# Altium schematic sheet Clock Sheet.SchDoc: Orologio
size A4; DrawnBy: Group 19; Revision: 1.0
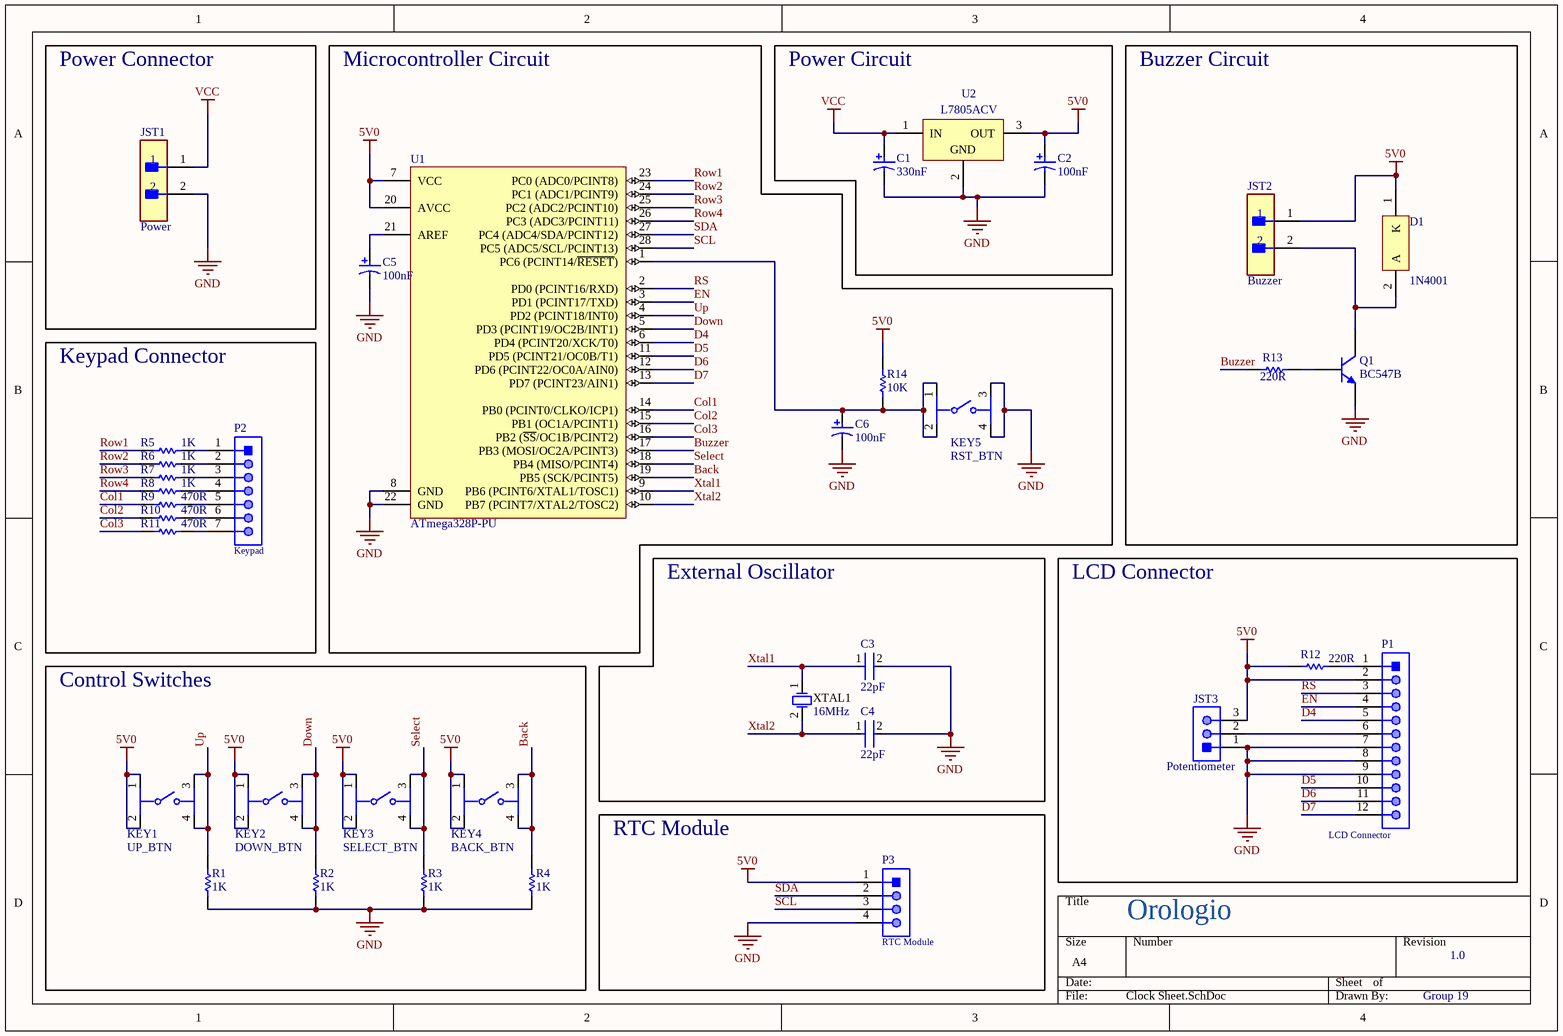
[diagram p0: Clock Sheet.SchDoc]

## Parts
C1  330nF  [CAPPR65-350-1150X800X1250]
C2  100nF  [CAPPR65-350-1150X800X1250]
C3  22pF  [FP-RCE0K1-MFG]
C4  22pF  [FP-RCE0K1-MFG]
C5  100nF  [CAPPR65-350-1150X800X1250]
C6  100nF  [CAPPR65-350-1150X800X1250]
D1  1N4001  [ONSC-AXIAL_LEAD-2-59-10_P]
JST1  Power  [FP-440054-2-MFG]
JST2  Buzzer  [FP-440054-2-MFG]
JST3  Potentiometer  [JST-B3B-PH-K-S-3_V]
KEY1  UP_BTN  [FP-1825910-2-0]
KEY2  DOWN_BTN  [FP-1825910-2-0]
KEY3  SELECT_BTN  [FP-1825910-2-0]
KEY4  BACK_BTN  [FP-1825910-2-0]
KEY5  RST_BTN  [FP-1825910-2-0]
P1  LCD Connector  [61301211121]
P2  Keypad  [61300711121]
P3  RTC Module  [61300411121]
Q1  BC547B  [ONSC-TO-92-3-29-11]
R1  1K  [AXIAL-0.3]
R2  1K  [AXIAL-0.3]
R3  1K  [AXIAL-0.3]
R4  1K  [AXIAL-0.3]
R5  1K  [AXIAL-0.3]
R6  1K  [AXIAL-0.3]
R7  1K  [AXIAL-0.3]
R8  1K  [AXIAL-0.3]
R9  470R  [AXIAL-0.3]
R10  470R  [AXIAL-0.3]
R11  470R  [AXIAL-0.3]
R12  220R  [AXIAL-0.3]
R13  220R  [AXIAL-0.3]
R14  10K  [AXIAL-0.3]
U1  ATmega328P-PU  [28P3]
U2  L7805ACV  [TO220]
XTAL1  16MHz  [FOX-FOXSLF160-20]

## Blocks framed on the sheet
Power Connector: JST1
Microcontroller Circuit: C5 C6 KEY5 R14 U1
Power Circuit: C1 C2 U2
Buzzer Circuit: D1 JST2 Q1 R13
Keypad Connector: P2 R5-R11
External Oscillator: C3 C4 XTAL1
LCD Connector: JST3 P1 R12
Control Switches: KEY1-KEY4 R1-R4
RTC Module: P3

## Nets
5V0: C2.1 D1.1(K) JST2.1 JST3.3 KEY1.1 KEY1.2 KEY2.1 KEY2.2 KEY3.1 KEY3.2 KEY4.1 KEY4.2 P1.2 P3.1 R12.1 R14.2 U1.7(VCC) U1.20(AVCC) U2.3(OUT)
GND: C1.2 C2.2 C3.2 C4.2 C5.2 C6.2 JST1.2 JST3.1 KEY5.3 KEY5.4 P1.7 P1.8 P1.9 P3.4 Q1.3(E) R1.2 R2.2 R3.1 R4.1 U1.8(GND) U1.22(GND) U2.2(GND)
VCC: C1.1 JST1.1 U2.1(IN)
Back: KEY4.3 KEY4.4 R4.2 U1.19(PB5_(SCK/PCINT5))
Buzzer: R13.1 U1.17(PB3_(MOSI/OC2A/PCINT3))
Col1: R9.2 U1.14(PB0_(PCINT0/CLKO/ICP1))
Col2: R10.2 U1.15(PB1_(OC1A/PCINT1))
Col3: R11.2 U1.16(PB2_(~{SS}/OC1B/PCINT2))
D4: P1.5 U1.6(PD4_(PCINT20/XCK/T0))
D5: P1.10 U1.11(PD5_(PCINT21/OC0B/T1))
D6: P1.11 U1.12(PD6_(PCINT22/OC0A/AIN0))
D7: P1.12 U1.13(PD7_(PCINT23/AIN1))
Down: KEY2.3 KEY2.4 R2.1 U1.5(PD3_(PCINT19/OC2B/INT1))
EN: P1.4 U1.3(PD1_(PCINT17/TXD))
Row1: R5.2 U1.23(PC0_(ADC0/PCINT8))
Row2: R6.2 U1.24(PC1_(ADC1/PCINT9))
Row3: R7.2 U1.25(PC2_(ADC2/PCINT10))
Row4: R8.2 U1.26(PC3_(ADC3/PCINT11))
RS: P1.3 U1.2(PD0_(PCINT16/RXD))
SCL: P3.3 U1.28(PC5_(ADC5/SCL/PCINT13))
SDA: P3.2 U1.27(PC4_(ADC4/SDA/PCINT12))
Select: KEY3.3 KEY3.4 R3.2 U1.18(PB4_(MISO/PCINT4))
Up: KEY1.3 KEY1.4 R1.1 U1.4(PD2_(PCINT18/INT0))
Xtal1: C3.1 U1.9(PB6_(PCINT6/XTAL1/TOSC1)) XTAL1.1
Xtal2: C4.1 U1.10(PB7_(PCINT7/XTAL2/TOSC2)) XTAL1.2
NetC5_1: C5.1 U1.21(AREF)
NetC6_1: C6.1 KEY5.1 KEY5.2 R14.1 U1.1(PC6_(PCINT14/~{RESET}))
NetD1_2: D1.2(A) JST2.2
NetJST3_2: JST3.2 P1.6
NetP1_1: P1.1 R12.2
NetP2_1: P2.1 R5.1
NetP2_2: P2.2 R6.1
NetP2_3: P2.3 R7.1
NetP2_4: P2.4 R8.1
NetP2_5: P2.5 R9.1
NetP2_6: P2.6 R10.1
NetP2_7: P2.7 R11.1
NetQ1_2: Q1.2(B) R13.2

Not connected (* = marked no-connect by the designer): Q1 1(C)

## Library data of the parts
C1 C2 C5 C6 = CMP-1665-00042-2: Aluminum Electrolytic Capacitor, 100 uF, +/- 20%, 50 V, -40 to 85 degC, 2-Pin THD, RoHS, Bulk; Manufacturer: Panasonic; Lead Diameter: 0.6mm; Dielectric Material: Aluminium; Voltage Rating (DC): 50V; Ripple Current (AC): 250mA; Polarity: Polar; Leakage Current: 3uA; Capacitance: 100uF; Life (Hours): 2000Hour; Lead/Base Style: Straight; Dissipation Factor: 0.12%; Radiation Hardening: No; Height: 11.5mm; Package Quantity: 200; Package Reference: CAPPR65-350-1150X800X1250; Min Operating Temperature: -40degC; Mount: ThroughHole; Package Description: 2-Pin Radial Lead, Dia 8 mm, Height 12.5 mm; Case/Package: Radial; Diameter: 8mm; Voltage Rating: 50V; Length: 11.5mm; REACH SVHC: NoSVHC; Height - Seated (Max): 0.492inch; Datasheet URL: https://industrial.panasonic.com/cdbs/www-data/pdf/RDF0000/ABA0000C1218.pdf; RoHSCompliant: true; Ripple Current: 250mA; Lead Free: LeadFree; Voltage: 50V; Manufacturer URL: http://www.panasonic.com/; Number of Pins: 2; Datasheet Version: Rev. 05, 10/2016; Packaging: Bulk; Termination: Radial; Max Operating Temperature: 85degC; Tolerance: 20%; Lead Pitch: 3.5mm
C3 C4 = CMP-06035-004895-1: Cap Ceramic 22pF 50V C0G ±5% Radial 5mm +125°C Automotive Bulk; Lead/Base Style: Formed Leads; Lead Diameter: 0.5mm; Max Operating Temperature: 125°C; Termination: Radial; Package Quantity: 2000; Capacitance: 22pF; Dielectric: C0G; Height - Seated (Max): 0.138inch; Width: 0.098inch; Lead Pitch: 0.197inch; Tolerance: 5%; Resistor Type: Ceramic; Case/Package: Radial; Mount: Through Hole; Voltage Rating: 50V; Ratings: AEC-Q200; Min Operating Temperature: -55°C; Packaging: Tape and Reel; Voltage Rating (DC): 50V; Height: 3.5mm; Length: 0.142inch
D1 = CMP-0902-00117-1: Standard Recovery Rectifier, 2-Pin Axial_Lead, Pb-Free, Bulk Bag; Manufacturer: On Semiconductor; VRRM Max (V): 50; IFSM Max (A): 30; IO(rec) Max (A): 1; ComponentLink3URL: http://www.onsemi.cn/pub_link/Collateral/59-10.PDF; ComponentLink3Description: Package Specification; PartNumber: 1N4001; PackageVersion: Rev. U, 02/2005; Packing: Bulk Bag; ComponentLink2Description: Datasheet; RoHS: TRUE; DatasheetVersion: Rev. 13; PackageReference: AXIAL_LEAD-2-59-10; ComponentLink1URL: http://www.onsemi.com/; Mounting Technology: Through Hole; PackageDescription: 2-Pin, Axial Lead, Diameter 2.35 mm; ComponentLink2URL: http://www.onsemi.com/pub_link/Collateral/1N4001-D.PDF; Type: Standard Recovery; ComponentLink1Description: Manufacturer URL
JST1 JST2 = CMP-03369-000005-1: CONN HEADER VERT 2POS 2MM; Manufacturer: TE Connectivity; Manufacturer Part Number: 440054-2; Conn Gender: Male; Conn Orientation: Vertical; Voltage Rating: 250V; Number Of Contacts: 2; Current Rating: 3A; ComponentLink2Description: Datasheet; Temperature Range Low: -25°C; Contact Material: Tin,Nickel; Device Class L3: unset; Digikey Description: CONN HEADER VERT 2POS 2MM; Temperature: -25°C to +85°C; Mouser Description: Headers & Wire Housings 2.0mm HDR 2pos VERT HPI; Package: 440054-2; Lead Free: Yes; ComponentLink2URL: https://www.te.com/usa-en/product-440054-2.datasheet.pdf; Number Of Rows: 1; Octopart: https://octopart.com/440054-2-te+connectivity-40237927; Category: Conn; Temperature Range High: +85°C; Footprint Url: https://www.te.com/commerce/DocumentDelivery/DDEController?Action=showdoc&DocId=Customer+Drawing%7F440054%7FF6%7Fpdf%7FEnglish%7FENG_CD_440054_F6.pdf%7F440054-2; Pitch: 2mm; Device Class L1: Connectors; RoHS: TRUE; Height: 6.35mm; Device Class L2: Headers and Wire Housings; Automotive: No
JST3 = CMP-2000-05164-1: Male Header, Pitch 2 mm, 1 x 3 Position, Height 6 mm, Tail Length 3.4 mm, -25 to 85 degC, RoHS, Bulk; Manufacturer: JST; Style/Orientation: StraightHeader/Plug; Pitch: 2mm; No of Positions: 3; Termination: Crimp; Manufacturer URL: http://www.jst.com/home2.html; Datasheet Version: Oct-06; Type: ShroudedHeader; Datasheet URL: https://datasheet.ciiva.com/11746/0900766b80826550-11746939.pdf
KEY1-KEY5 = CMP-03407-000004-1: SWITCH TACTILE SPST-NO 0.05A 24V; Manufacturer: TE; Manufacturer Part Number: 1825910-2; Contact Current Rating: 50mA; Operating Force: 160gf; Contact Resistance: 100mΩ; Electromechanical Life: 100000Cycles; Package: 0; ComponentLink2Description: Datasheet; Digikey Description: SWITCH TACTILE SPST-NO 0.05A 24V; Octopart: https://octopart.com/1825910-2-te+connectivity-42270502; Temperature Range Low: -35°C; Temperature Range High: +85°C; Lead Free: Yes; Device Class L2: Switches; Automotive: No; Temperature: -35°C to +85°C; Device Class L1: Electromechanical; Category: Switch; ComponentLink2URL: https://www.te.com/commerce/DocumentDelivery/DDEController?Action=showdoc&DocId=Customer+Drawing%7F1825910%7FC10%7Fpdf%7FEnglish%7FENG_CD_1825910_C10.pdf%7F1825910-2; Mount: Through Hole; RoHS: TRUE; Height: 4.6mm; Device Class L3: Tactile Switches; Voltage Rating Dc: 24V; Throw Configuration: SPST-NO
P1 = CMP-1502-01086-1: THT Vertical Pin Header WR-PHD, Pitch 2.54 mm, Single Row, 12 pins; Manufacturer: Wurth Elektronik; Pin Number: 12; Gender: Male; Working Voltage: 250VAC; Rated Current: 3A; Withstanding Voltage: 500VAC; Pitch: 2.54mm; Contact Resistance: 20mOhm; Orientation: Vertical; Package Reference: 61301211121; Packaging: Bag; Operating Temperature: -40to105degC; Mounting Technology: THT; Part Number: 61301211121; Manufacturer URL: http://www.we-online.de; Row Number: Single; Publisher: WurthElektronik; Datasheet URL: https://katalog.we-online.de/em/datasheet/6130xx11121.pdf
P2 = CMP-1502-01074-1: THT Vertical Pin Header WR-PHD, Pitch 2.54 mm, Single Row, 7 pins; Manufacturer: Wurth Elektronik; Pin Number: 7; Gender: Male; Working Voltage: 250VAC; Contact Resistance: 20mOhm; Rated Current: 3A; Pitch: 2.54mm; Withstanding Voltage: 500VAC; Row Number: Single; Packaging: Bag; Orientation: Vertical; Manufacturer URL: http://www.we-online.de; Datasheet URL: https://katalog.we-online.de/em/datasheet/6130xx11121.pdf; Part Number: 61300711121; Publisher: WurthElektronik; Operating Temperature: -40to105degC; Mounting Technology: THT; Package Reference: 61300711121
P3 = CMP-1502-01064-1: THT Vertical Pin Header WR-PHD, Pitch 2.54 mm, Single Row, 4 pins; Manufacturer: Wurth Elektronik; Withstanding Voltage: 500VAC; Rated Current: 3A; Working Voltage: 250VAC; Pin Number: 4; Gender: Male; Contact Resistance: 20mOhm; Pitch: 2.54mm; Manufacturer URL: http://www.we-online.de; Operating Temperature: -40to105degC; Packaging: Bag; Mounting Technology: THT; Package Reference: 61300411121; Datasheet URL: https://katalog.we-online.de/em/datasheet/6130xx11121.pdf; Publisher: WurthElektronik; Part Number: 61300411121; Row Number: Single; Orientation: Vertical
Q1 = NPN: NPN Bipolar Transistor; Published: 8-Jun-2000; LatestRevisionDate: 17-Jul-2002; LatestRevisionNote: Re-released for DXP Platform.; PackageReference: TO-226-AA; Publisher: Altium Limited; PackageDescription: TO, Flat Index; 3 In-Line, Axial Leads; Body Dia. 4.8mm; Leads 0.55 x 0.51 mm (max); Code_JEDEC: TO-226-AA
R1-R14 = Res1: Resistor; Published: 8-Jun-2000; LatestRevisionDate: 17-Jul-2002; LatestRevisionNote: Re-released for DXP Platform.; PackageReference: AXIAL-0.3; Publisher: Altium Limited; PackageDescription: Axial Device, Thru-Hole; 2 Leads; 0.3 in Pin Spacing
U1 = CMP-0095-00013-2: 8-bit AVR Microcontroller, 32KB Flash, 1KB EEPROM, 2KB SRAM, 28-pin PDIP, Industrial Grade (-40°C to 85°C); RevisionNote: DatasheetVersion updated. URLs added.; PackageVersion: revB, Sep-2001; PackageDescription: 28-lead (0.300"/7.62mm Wide) Plastic Dual Inline Package (PDIP); DatasheetVersion: revD, May-2011; ComponentLink1Description: Manufacturer URL; ComponentLink1URL: http://www.atmel.com/; PackageReference: 28P3; ComponentLink2Description: ATmega48A/48PA/88A/88PA/168A/168PA/328/328P Datasheet; ComponentLink3URL: http://www.atmel.com/dyn/resources/prod_documents/8271S.pdf; ComponentLink2URL: http://www.atmel.com/dyn/resources/prod_documents/8271.pdf; ComponentLink3Description: ATmega48A/48PA/88A/88PA/168A/168PA/328/328P Summary
U2 = CMP-0244-00484-1: Positive Voltage Regulator, 5V, 3-Pin TO-220; DatasheetVersion: 16/11/2011; ComponentLink2Description: Datasheet; ComponentLink3Description: Package Specification; ComponentLink2URL: http://www.st.com/internet/com/TECHNICAL_RESOURCES/TECHNICAL_LITERATURE/DATASHEET/CD00000444.pdf; PackageDescription: TO, Thru-Hole, Vertical, Heatsink Mounted; 3 In-Line Leads; Pitch 2.54 mm; ComponentLink3URL: http://www.st.com/internet/com/TECHNICAL_RESOURCES/TECHNICAL_LITERATURE/PACKAGE_INFORMATION/CD00004649.pdf; PackageReference: TO220; ComponentLink1URL: http://www.st.com; PackageVersion: ver3.0; ComponentLink1Description: Manufacturer URL
XTAL1 = CMP-1749-00003-1: Resistance Weld Thru-Hole Crystal, 16 MHz, -20 to 70 degC, 2-Pin THD, RoHS, Bulk; Voltage Rating: 250 V; Tolerance: 1%; Resistance: 221 kohm; Case\Package: Axial; Power Rating: 250 mW; RoHSCompliant: true; Package Quantity: 200; Packaging: Bulk; Min Operating Temperature: -55 degC; DatasheetVersion: Mar-15; ComponentLink1URL: http://www.foxonline.com/; Max Operating Temperature: 155 degC; PackageReference: FOXSLF160-20; Mount: Through Hole; PackageDescription: 2-Pin Through Hole Device, Body 11.35 x 4.65 mm; ComponentLink1Description: Manufacturer URL; ComponentLink2URL: http://www.foxonline.com/pdfs/hc49slf.pdf; ComponentLink2Description: Datasheet; Length: 0.248 inch